# EasyEDA Pro project ZeptoWatch.eprj, board PCB4
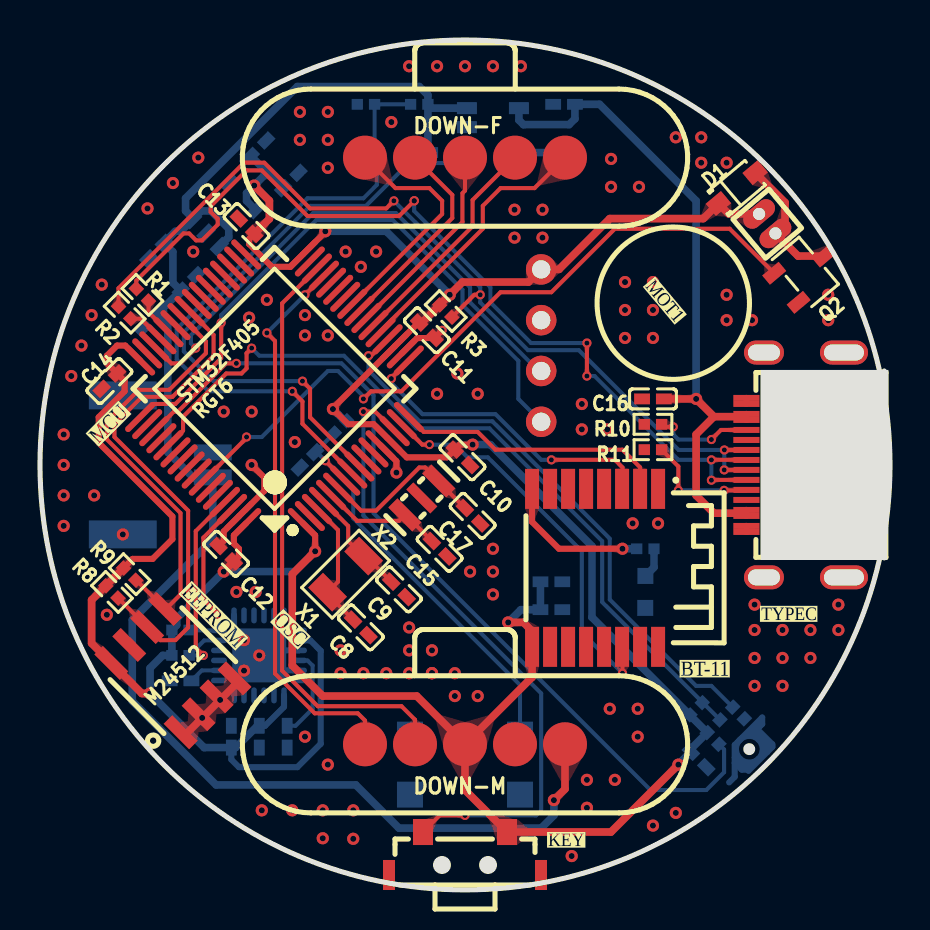
[diagram p12: board, top side]
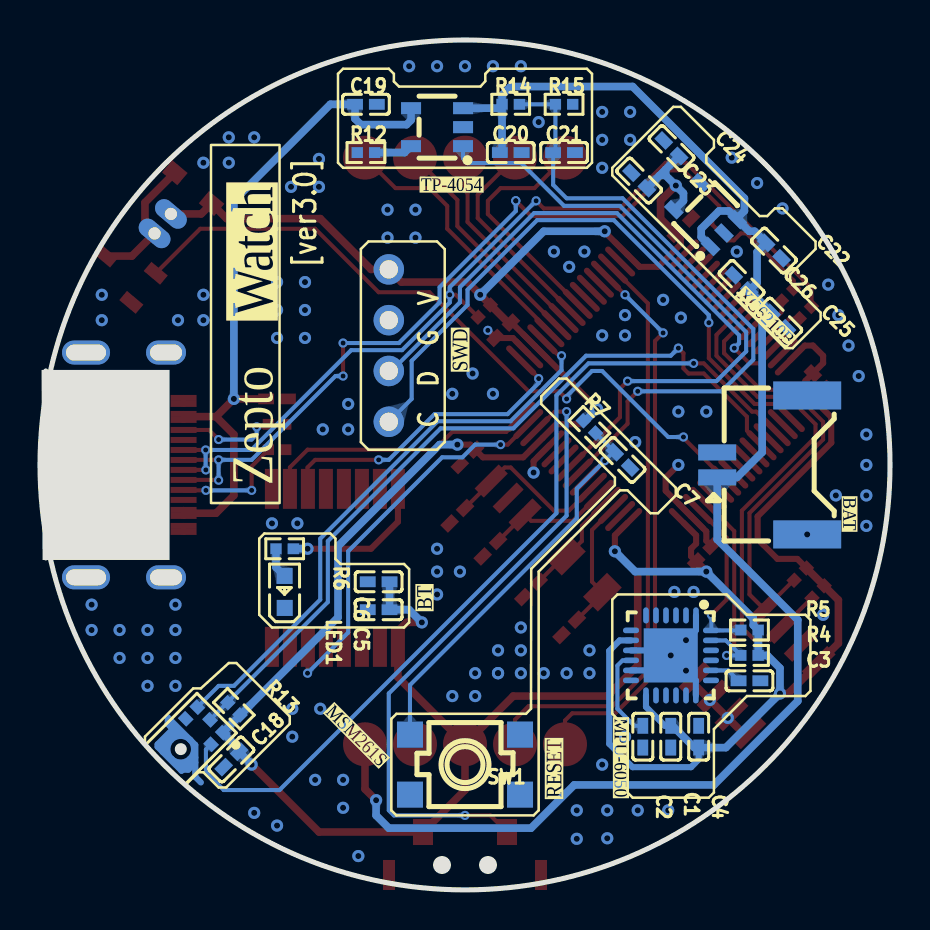
[diagram p13: board, bottom side, seen from below]

Outline 42.5 x 42.5 mm; copper layers: Top Layer, Bottom Layer. Coordinates in mm from the lower left corner of the outline.
Outline path: circle c21.25,21.25 r21.25
Stack: Top Layer 0.035mm / Dielectric1 1.51mm FR4 er 4.5 / Bottom Layer 0.035mm

## Design rules (mm)
spacing safeClearance (default): track to track 0.152, other pairs 0 to 0.152
track width trackWidth (default): min 0.127, default 0.254, max 2.54
differential pair differentialPair (default): width min 0.127, default 0.254, max 2.54; gap min 0.152, default 0.152
via viaSize (default): diameter min 0.381, default 0.457, max 10; hole min 0.203, default 0.254, max 5.999

## Placement (name value [footprint] x y rotation side)
 BAT   -  [CONN-SMD_2P-P1.25_L5.5-W7.7-2PWB]  6.39 21.25 90 bottom
 BT-11   -  [BT-11]  34.2 19.85 270 top
 KEY   -  [SW-SMD_TS-KG012EV]  21.25 1.82 0 top
 MOT1   -  [VIBRATING-MOTOR-SMD_WELDING]  36.36 33.31 130 top
 MPU-6050   -  [QFN-24_L4.0-W4.0-P0.50-BL-EP2.7]  10.95 11.72 0 bottom
 MSM261S   -  [MIC-SMD_6P-L3.5-W2.7-P0.90-TR]  34.97 7.53 225 bottom
 TP-4054   -  [SOT-23-5_L3.0-W1.7-P0.95-LS2.8-BR]  22.65 38.14 180 bottom
 TYPEC   -  [USB-C-SMD_TYPE-C-16M-005]  37.76 21.25 90 top
 XC6210B   -  [SOT-25_L3.0-W1.6-P0.95-LS2.8-BL]  9.22 33.77 135 bottom
C1  100nF  [C0402]  10.96 7.66 90 bottom
C2  100nF  [C0402]  12.36 7.66 270 bottom
C3  2.2nF  [C0402]  7.03 10.45 180 bottom
C4  100nF  [C0402]  9.57 7.66 270 bottom
C5  100nF  [C0402]  25.57 14.01 0 bottom
C6  10uF  [C0402]  25.57 15.41 180 bottom
C7  100nF  [C0402]  13.38 21.5 45 bottom
C8  10pF  [C0402]  16.04 13.13 135 top
C9  10pF  [C0402]  17.95 15.03 135 top
C10  100nF  [C0402]  21.12 21.63 315 top
C11  100nF  [C0402]  19.34 27.99 315 top
C12  100nF  [C0402]  9.31 16.81 135 top
C13  100nF  [C0402]  10.33 33.19 135 top
C14  100nF  [C0402]  3.47 25.44 45 top
C15  20pF  [C0402]  19.98 17.06 135 top
C16  10uF  [C0402]  30.65 24.55 0 top
C17  20pF  [C0402]  21.63 18.71 135 top
C18  100nF  [C0402]  32.93 6.52 315 bottom
C19  100nF  [C0402]  26.2 39.28 180 bottom
C20  100nF  [C0402]  18.96 36.87 180 bottom
C21  100nF  [C0402]  16.3 36.87 180 bottom
C22  100nF  [C0402]  5.81 31.97 225 bottom
C23  100nF  [C0402]  12.54 35.47 45 bottom
C24  10uF  [C0402]  10.92 37.09 225 bottom
C25  10uF  [C0402]  5.54 28.47 45 bottom
C26  100nF  [C0402]  7.42 30.36 45 bottom
D1  B5819WS  [SOD-323_L1.8-W1.3-LS2.5-FD]  34.84 35.09 220 top
DOWN-F  -  [pogo-5pin-f]  21.25 36.62 180 top
DOWN-M  -  [pogo-5pin-m]  21.25 7.28 180 top
LED1  D-060306B1  [LED0603-RD]  30.27 14.9 90 bottom
M24512  M24512-DRMN8TP/K  [SO-8_L4.9-W3.9-P1.27-LS6.0-BL]  6.65 10.96 45 top
NOREF  -  [Pad_e232]  25.06 25.95 45 top
NOREF#2  -  [Pad_e231]  25.06 28.49 45 top
NOREF#3  -  [Pad_e230]  25.06 31.03 45 top
NOREF#4  -  [Pad_e233]  25.06 23.41 45 top
Q2  AO3400A  [SOT-23-3_L2.9-W1.6-P1.90-LS2.8-BR]  38.27 30.9 220 top
R1  22Ω  [R0402]  5.12 29.76 315 top
R2  22Ω  [R0402]  4.23 28.87 315 top
R3  1.5kΩ  [R0402]  20.29 28.94 315 top
R4  2.2kΩ  [R0402]  7.03 11.72 0 bottom
R5  2.2kΩ  [R0402]  7.03 13 0 bottom
R6  1kΩ  [R0402]  30.27 17.06 180 bottom
R7  47kΩ  [R0402]  15.03 23.16 45 bottom
R8  10kΩ  [R0402]  3.6 14.9 315 top
R9  10kΩ  [R0402]  4.49 15.79 315 top
R10  5.1kΩ  [R0402]  30.65 23.28 0 top
R11  5.1kΩ  [R0402]  30.65 22.01 180 top
R12  2kΩ  [R0402]  26.2 36.87 180 bottom
R13  100kΩ  [R0402]  32.81 9.06 45 bottom
R14  20kΩ  [R0402]  18.96 39.28 180 bottom
R15  20kΩ  [R0402]  16.3 39.28 180 bottom
STM32F405
RGT6  -  [LQFP-64_L10.0-W10.0-P0.50-LS12.0-BL]  11.72 25.06 45 top
SW1  TS-1127-C  [SW-SMD_4P-L4.5-W4.5-P3.00-LS6.0]  21.25 6.26 180 bottom
X1  32.768kHz  [OSC-SMD_L3.2-W1.5]  15.28 15.79 225 top
X2  8MHz  [OSC-SMD_3P-L3.2-W1.3-P1.2-L]  19.09 19.6 45 top

## Footprints (pads in the part's own frame, mm; a bottom-side part is the same pattern mirrored in y, then rotated)
BT-11
  rect 2x0.7 smd: 1(-0.2,-3.3) 2(-0.2,-4.2) 3(-0.2,-5.1) 4(-0.2,-6) 5(-0.2,-6.9) 6(-0.2,-7.8) 7(-0.2,-8.7) 8(-0.2,-9.6) 9(7.7,-9.6) 10(7.7,-8.7) 11(7.7,-7.8) 12(7.7,-6.9) 13(7.7,-6) 14(7.7,-5.1) 15(7.7,-4.2) 16(7.7,-3.3)
C0402
  rect 0.79x0.54 smd: 1(-0.545,0) 2(0.545,0)
CONN-SMD_2P-P1.25_L5.5-W7.7-2PWB
  rect 0.8x1.9 smd: 1(-0.625,2.25) 2(0.625,2.25)
  rect 1.4x3.4 smd: 3(3.475,-2.25) 4(-3.475,-2.25)
LED0603-RD
  rect 0.8x0.8 smd: 1(-0.799,-0.004) 2(0.799,0.004)
LQFP-64_L10.0-W10.0-P0.50-LS12.0-BL
  oval 0.3x2 smd: 1(-3.75,-5.75) 2(-3.25,-5.75) 3(-2.75,-5.75) 4(-2.25,-5.75) 5(-1.75,-5.75) 6(-1.25,-5.75) 7(-0.75,-5.75) 8(-0.25,-5.75) 9(0.25,-5.75) 10(0.75,-5.75) 11(1.25,-5.75) 12(1.75,-5.75) 13(2.25,-5.75) 14(2.75,-5.75) 15(3.25,-5.75) 16(3.75,-5.75) 33(3.75,5.75) 34(3.25,5.75) 35(2.75,5.75) 36(2.25,5.75) 37(1.75,5.75) 38(1.25,5.75) 39(0.75,5.75) 40(0.25,5.75) 41(-0.25,5.75) 42(-0.75,5.75) 43(-1.25,5.75) 44(-1.75,5.75) 45(-2.25,5.75) 46(-2.75,5.75) 47(-3.25,5.75) 48(-3.75,5.75)
  oval 2x0.3 smd: 17(5.75,-3.75) 18(5.75,-3.25) 19(5.75,-2.75) 20(5.75,-2.25) 21(5.75,-1.75) 22(5.75,-1.25) 23(5.75,-0.75) 24(5.75,-0.25) 25(5.75,0.25) 26(5.75,0.75) 27(5.75,1.25) 28(5.75,1.75) 29(5.75,2.25) 30(5.75,2.75) 31(5.75,3.25) 32(5.75,3.75) 49(-5.75,3.75) 50(-5.75,3.25) 51(-5.75,2.75) 52(-5.75,2.25) 53(-5.75,1.75) 54(-5.75,1.25) 55(-5.75,0.75) 56(-5.75,0.25) 57(-5.75,-0.25) 58(-5.75,-0.75) 59(-5.75,-1.25) 60(-5.75,-1.75) 61(-5.75,-2.25) 62(-5.75,-2.75) 63(-5.75,-3.25) 64(-5.75,-3.75)
MIC-SMD_6P-L3.5-W2.7-P0.90-TR
  rect 0.6x0.52 smd: 1(0.9,1.367) 2(0.9,0.545) 4(-0.9,0.545) 5(-0.9,1.367) 6(0,1.368)
  custom 0x0 smd: 3(0,-1.368) 3(0,-0.042)
OSC-SMD_3P-L3.2-W1.3-P1.2-L
  rect 0.65x1.7 smd: 1(-1.199,0) 3(1.199,0)
  rect 0.5x1.7 smd: 2(0,0)
OSC-SMD_L3.2-W1.5
  rect 1.049x1.7 smd: 1(-1.275,0) 2(1.275,0)
Pad_e230
  round 1.524 hole 0.914: 1(0,0)
Pad_e231
  round 1.524 hole 0.914: 2(0,0)
Pad_e232
  round 1.524 hole 0.914: 3(0,0)
Pad_e233
  round 1.524 hole 0.914: 4(0,0)
pogo-5pin-f
  round 2.2 smd: 1(5,0) 2(2.5,0) 3(0,0) 4(-2.5,0) 5(-5,0)
pogo-5pin-m
  round 2.2 smd: 1(-5,0) 2(-2.5,0) 3(0,0) 4(2.5,0) 5(5,0)
QFN-24_L4.0-W4.0-P0.50-BL-EP2.7
  oval 0.28x0.8 smd: 1(-1.25,-2) 2(-0.75,-2) 3(-0.25,-2) 4(0.25,-2) 5(0.75,-2) 6(1.25,-2) 13(1.25,2) 14(0.75,2) 15(0.25,2) 16(-0.25,2) 17(-0.75,2) 18(-1.242,2)
  oval 0.8x0.28 smd: 7(2,-1.25) 8(2,-0.75) 9(2,-0.25) 10(2,0.25) 11(2,0.75) 12(2,1.25) 19(-2,1.25) 20(-2,0.75) 21(-2,0.25) 22(-2,-0.25) 23(-2,-0.75) 24(-2,-1.25)
  rect 2.7x2.7 smd: 25(0.013,0)
R0402
  rect 0.566x0.54 smd: 1(-0.433,0) 2(0.433,0)
SO-8_L4.9-W3.9-P1.27-LS6.0-BL
  rect 0.6x1.801 smd: 1(-1.905,-2.451) 2(-0.635,-2.451) 3(0.635,-2.451) 4(1.905,-2.451) 5(1.905,2.451) 6(0.635,2.451) 7(-0.635,2.451) 8(-1.905,2.451)
SOD-323_L1.8-W1.3-LS2.5-FD
  rect 1x0.8 smd: 1(-1.2,0) 2(1.2,0)
SOT-23-3_L2.9-W1.6-P1.90-LS2.8-BR
  rect 1.07x0.6 smd: 1(1.235,-0.95) 2(1.235,0.95) 3(-1.235,0)
SOT-23-5_L3.0-W1.7-P0.95-LS2.8-BR
  rect 1x0.6 smd: 1(1.3,-0.95) 2(1.3,0) 3(1.3,0.95) 4(-1.3,0.95) 5(-1.3,-0.95)
SOT-25_L3.0-W1.6-P0.95-LS2.8-BL
  rect 0.5x0.899 smd: 1(-0.95,-1.3) 2(0,-1.3) 3(0.95,-1.3) 4(0.95,1.3) 5(-0.95,1.3)
SW-SMD_4P-L4.5-W4.5-P3.00-LS6.0
  rect 1.3x1.3 smd: 1(-2.751,1.501) 2(2.751,1.501) 3(-2.751,-1.501) 4(2.751,-1.501)
SW-SMD_TS-KG012EV
  rect 1.001x1.3 smd: 1(2.1,1.075) 2(-2.1,1.075)
  rect 0.6x1.501 smd: 3(-3.8,-1.075) 4(3.8,-1.075)
USB-C-SMD_TYPE-C-16M-005
  oval 1.199x1.999 hole 0.8x1.6: 17(5.621,1.562) 20(-5.621,1.562)
  oval 1.199x2.401 hole 0.8x1.999: 18(5.621,-2.438) 19(-5.621,-2.438)
  rect 0.299x1.3 smd: A1(-3.35,2.438) A4(-2.55,2.438) A5(-1.25,2.438) A6(-0.249,2.438) A7(0.249,2.438) A8(1.25,2.438) A9(2.55,2.438) A12(3.35,2.438) B1(3.05,2.438) B4(2.251,2.438) B5(1.75,2.438) B6(0.75,2.438) B7(-0.75,2.438) B8(-1.75,2.438) B9(-2.251,2.438) B12(-3.05,2.438)
VIBRATING-MOTOR-SMD_WELDING
  oval 0.9x1.8 hole 0.61: 1(-0.635,0) 2(0.635,0)

## Nets
GND:  BAT .2  BAT .3  BAT .4  BT-11 .1  BT-11 .15  KEY .3  KEY .4  MPU-6050 .1  MPU-6050 .9  MPU-6050 .11  MPU-6050 .18  MPU-6050 .25  MSM261S .3  MSM261S .4  TP-4054 .2  TYPEC .17  TYPEC .18  TYPEC .19  TYPEC .20  TYPEC .A1  TYPEC .A12  TYPEC .B1  TYPEC .B12  XC6210B .2 C1.1 C2.2 C3.2 C4.1 C5.2 C6.1 C7.1 C8.1 C9.1 C10.2 C11.2 C12.2 C13.2 C14.1 C15.1 C16.1 C17.1 C18.2 C19.2 C20.2 C21.2 C22.2 C23.2 C24.1 C25.1 C26.2 DOWN-M.2 LED1.1 M24512.1 M24512.2 M24512.3 M24512.4 M24512.7 NOREF#2.2 Q2.2 R10.1 R11.2 R12.1 R15.2 STM32F405
RGT6.12 STM32F405
RGT6.18 STM32F405
RGT6.63 SW1.3 X2.2
VBAT:  BAT .1  TP-4054 .3  XC6210B .1  XC6210B .3 C20.1 C22.1 C25.2 C26.1 DOWN-M.1 R14.1
VBUS:  TP-4054 .4  TYPEC .A4  TYPEC .A9  TYPEC .B4  TYPEC .B9 C16.2 C19.1
VCC_3V3:  BT-11 .9  KEY .1  MOT1 .2  MPU-6050 .8  MPU-6050 .13  MSM261S .1  XC6210B .5 C1.2 C4.2 C5.1 C6.2 C10.1 C11.1 C12.1 C13.1 C14.2 C18.1 C23.1 C24.2 D1.2 DOWN-M.3 M24512.8 NOREF#3.1 R3.1 R4.1 R5.1 R7.2 R8.1 R9.1 R13.1 STM32F405
RGT6.1 STM32F405
RGT6.13 STM32F405
RGT6.19 STM32F405
RGT6.32 STM32F405
RGT6.48 STM32F405
RGT6.64
BAT_ADC: C21.1 R14.2 R15.1 STM32F405
RGT6.8
BAT_CHRG_R:  TP-4054 .1 STM32F405
RGT6.9
BT_RST:  BT-11 .14 STM32F405
RGT6.15
I2S_CK:  MSM261S .2 STM32F405
RGT6.51
I2S_SD:  MSM261S .6 R13.2 STM32F405
RGT6.53
I2S_WS:  MSM261S .5 STM32F405
RGT6.20
IMU_SCL:  MPU-6050 .23 R4.2 STM32F405
RGT6.61
IMU_SDA:  MPU-6050 .24 R5.2 STM32F405
RGT6.62
KEY_INT:  KEY .2 STM32F405
RGT6.14
LCD_BLK: DOWN-F.4 STM32F405
RGT6.22
LCD_DC: DOWN-F.1 STM32F405
RGT6.25
LCD_RST: DOWN-F.2 STM32F405
RGT6.24
LCD_SCL: DOWN-F.5 STM32F405
RGT6.21
LCD_SDA: DOWN-F.3 STM32F405
RGT6.23
MOTOR: Q2.1 STM32F405
RGT6.58
OSC32_IN: C8.2 STM32F405
RGT6.3 X1.2
OSC32_OUT: C9.2 STM32F405
RGT6.4 X1.1
OSC_IN: C15.2 STM32F405
RGT6.5 X2.1
OSC_OUT: C17.2 STM32F405
RGT6.6 X2.3
ROM_SCL: M24512.6 R8.2 STM32F405
RGT6.41
ROM_SDA: M24512.5 R9.2 STM32F405
RGT6.42
SWCLK: NOREF#4.4 STM32F405
RGT6.49
SWDIO: NOREF.3 STM32F405
RGT6.46
TP_SCL: DOWN-M.5 STM32F405
RGT6.29
TP_SDA: DOWN-M.4 STM32F405
RGT6.30
UART_RX:  BT-11 .3 STM32F405
RGT6.17
UART_TX:  BT-11 .2 STM32F405
RGT6.16
USB_DN: R1.2 STM32F405
RGT6.44
USB_DN_IN:  TYPEC .A7  TYPEC .B7 R1.1
USB_DP: R2.2 STM32F405
RGT6.45
USB_DP_IN:  TYPEC .A6  TYPEC .B6 R2.1 R3.2
$1N145557:  MPU-6050 .10 C2.1
$1N145559:  MPU-6050 .20 C3.1
$1N145571: C7.2 R7.1 STM32F405
RGT6.7 SW1.1
$1N145574:  TYPEC .B5 R10.2
$1N145577:  TYPEC .A5 R11.1
$1N145631:  MOT1 .1 D1.1 Q2.3
$1N145644:  TP-4054 .5 R12.2
$1N145663: LED1.2 R6.1
$1N145664:  BT-11 .8 R6.2

Pads without a net:  BT-11  4 5 6 7 10 11 12 13 16;  MPU-6050  2 3 4 5 6 7 12 14 15 16 17 19 21 22;  TYPEC  A8 B8;  XC6210B  4; STM32F405
RGT6 2 10 11 26 27 28 31 33 34 35 36 37 38 39 40 43 47 50 52 54 55 56 57 59 60; SW1 2 4

## Via types
v1: diameter 0.61, hole 0.305, Top Layer to Bottom Layer, 134 vias
v2: diameter 0.457, hole 0.254, Top Layer to Bottom Layer, 35 vias

## Routing (per net, layer and track width the routed paths; a pad name or vN(x,y) marks a point on that pad's centre or on a via; arc(x,y) is an arc through that point)
GND: length 33.3
  Top Layer w0.305: v2(20.11,27.98) C11.2 19.72,27.6 18.86,27.6 18.09,26.83 ; C12.2 9.19,17.46 9.19,17.92 STM32F405
RGT6.63 11.22,19.96 11.22,20.61 v1(10.58,21.25) ;  TYPEC .A1  TYPEC .B12 ; v1(17.82,20.87) 17.82,21.44 STM32F405
RGT6.12 ;  TYPEC .B1  TYPEC .A12
  Top Layer w0.381: 9.91,10.4 v1(9.01,9.5) v1(8.11,8.6) 7.21,7.7
  Bottom Layer w0.305: 35.73,8.17 35.73,7.92 35.6,7.79 35.85,7.79 36.36,7.28 36.36,6.9 ; 35.73,8.17 35.98,8.17 36.11,8.3 36.11,8.62  MSM261S .3 34.74,7.25 34.74,6.62 ; 35.73,8.17 36.62,7.28 36.62,7.15 36.36,6.9 ; 36.36,6.9 35.43,5.96 35.38,6.01 ; 35.38,6.01 35.5,6.14 ; 35.38,6.01 35.09,6.01 34.74,6.37 ; 35.5,6.14 35.93,6.57 ; 35.5,6.14 35.22,6.14 34.74,6.62 ;  MPU-6050 .11 11.71,10.97 v1(10.96,11.72) 11.21,11.97  MPU-6050 .9 ; v1(10.2,10.96) 9.71,10.47  MPU-6050 .18 ; v1(10.2,12.49) 9.7,12.99  MPU-6050 .1 ; 34.74,6.37 34.74,6.62 ; 34.74,6.37 34.74,5.65 34.46,5.38
  vias: v1(1.18,22.77) v1(1.18,21.25) v1(1.18,19.73) v1(1.18,18.2) v1(1.56,25.69) v1(2.07,27.22) v1(2.58,28.74) v1(2.71,19.73) v1(3.09,30.27) v1(3.34,13.76) v1(4.14,17.78) v1(5.38,34.08) v1(6.65,35.35) v1(7.66,31.92) v1(7.91,36.62) v1(9.19,23.92) v1(9.82,14.9) v1(10.46,28.62) v1(10.58,23.92) v1(10.78,14.9) v1(11.09,3.98) v1(11.34,29.5) v1(12.61,3.98) v1(12.74,22.39) v1(13,38.9) v1(13,37.51) v1(13.25,28.74) v1(13.25,27.73) v1(13.25,7.66) v1(14.14,3.98) v1(14.14,2.58) v1(14.39,38.9) v1(14.39,37.51) v1(14.39,36.11) v1(14.39,27.73) v1(14.39,6.26) v1(15.03,11.98) v1(15.03,10.84) v1(15.28,31.92) v1(15.66,3.98) v1(15.66,2.55) v1(16.04,31.16) v1(16.17,10.84) v1(16.81,31.92) v1(17.31,10.84) v1(17.57,38.39) v1(18.46,41.19) v1(18.46,13.12) v1(18.46,11.98) v1(18.46,10.84) v1(19.6,11.98) v1(19.6,10.84) v1(19.6,10.84) v1(19.85,41.19) v1(19.85,24.81) v1(20.74,10.84) v1(20.74,9.69) v1(20.87,25.82) v1(21.25,41.19) v1(21.5,15.92) v1(21.88,24.81) v1(21.88,9.69) v1(22.65,41.19) v1(22.65,17.06) v1(22.65,15.92) v1(22.65,14.77) v1(23.73,34.01) v1(23.73,32.62) v1(24.04,41.19) v1(25.12,34.01) v1(25.12,32.62) v1(26.58,1.69) v1(27.09,24.3) v1(27.09,23.03) v1(27.35,5.5) v1(27.35,4.11) v1(28.36,23.03) v1(28.49,9.06) v1(28.55,36.55) v1(28.55,35.16) v1(28.74,5.5) v1(29.25,30.39) v1(29.25,29) v1(29.25,27.6) v1(29.63,18.33) v1(29.89,9.06) v1(29.89,7.66) v1(29.95,35.16) v1(30.65,30.39) v1(30.65,29) v1(30.65,27.6) v1(30.65,3.22) v1(30.9,18.33) v1(31.79,37.63) v1(31.79,3.85) v1(33.06,37.63) v1(33.06,36.36) v1(34.33,36.36) v1(34.33,29.76) v1(34.33,28.49) v1(35.6,28.49) v1(35.73,14.27) v1(35.73,13) v1(35.73,11.6) v1(35.73,10.2) v1(37.12,13) v1(37.12,11.6) v1(37.12,10.2) v1(38.52,13) v1(38.52,11.6) v1(39.41,29.76) v1(39.41,28.49) v1(39.92,14.27) v1(39.92,13)
VBAT: length 81
  Top Layer w0.381: v1(25.69,4.49) 26.25,5.04 DOWN-M.1
  Bottom Layer w0.381:  XC6210B .1 9.44,32.65 9.44,33.06 8.55,33.95 8.06,33.95  XC6210B .3 ;  XC6210B .3 7.04,32.93 6.77,32.93 6.19,32.36 6.65,31.9 6.65,30.36 C26.1 5.92,28.85 6.39,28.38 6.39,21.89 7.65,20.62  BAT .1 8.64,17.53 4.61,13.5 4.61,9.44 8.8,5.25 15.79,5.25 17.95,3.09 25.06,3.09 25.69,3.72 v1(25.69,4.49) ;  XC6210B .3 7.63,33.6 7.28,33.95 7.28,34.58 12.87,40.17 18.96,40.17 19.4,39.74 R14.1 ; 21.35,39.09 19.59,39.09 R14.1 ; R14.1 19.4,36.98 C20.1
VBUS: length 34.7
  Top Layer w0.305:  TYPEC .A4  TYPEC .B9 35.16,18.84 ;  TYPEC .A9  TYPEC .B4 35.16,23.66
  Top Layer w0.381: 31.19,24.55 v1(32.81,24.55) 33.7,23.66 ; 33.7,23.66 32.81,22.77 32.81,19.73 33.7,18.84 35.16,18.84 ; 33.7,23.66 35.16,23.66
  Bottom Layer w0.381: 23.95,39.09 23.95,38.49 24.17,38.27 26.46,38.27 26.75,38.56 C19.1 27.98,39.28 32.81,34.46 v1(32.81,24.55)
VCC_3V3: length 185.5
  Top Layer w0.305: 9.69,16.42 9.95,16.68 9.95,17.06 9.69,17.31 9.69,17.72 STM32F405
RGT6.64 ; 13.14,18.34 13.76,17.72 v1(13.76,16.93) ; STM32F405
RGT6.48 4.26,27.22 3.85,27.22 3.34,26.71 3.34,26.34 C14.2 4.23,25.45 4.23,24.93 2.94,23.64 2.94,22.36 6.62,18.67 6.62,17.54 5.63,16.55 4.64,16.55 4.18,16.09 ; v1(21.63,22.27) 20.99,22.27 C10.1 20.35,21.63 18.34,21.63 STM32F405
RGT6.13 16.68,23.29 15.4,23.29 v1(14.65,24.04) 14.65,24.09 STM32F405
RGT6.19 18.93,28.37 ; C13.1 10.46,32.54 10.46,32.3 11.6,31.16 12.52,31.16 14.26,32.9 v1(14.26,32.93)
  Top Layer w0.381: 18.96,28.37 19.1,28.37 v1(20.49,29.76) 21.12,30.39 24.43,30.39 NOREF#3.1 25.95,31.03 28.49,33.57 33.17,33.57 D1.2 34.44,33.8  MOT1 .2 ; DOWN-M.3 24.6,10.63 24.6,12.94 24.17,13.38 v1(23.41,13.38) ; DOWN-M.3 18.84,9.69 14.14,9.69 12.61,11.22 12.61,15.79 v1(13.76,16.93) ; DOWN-M.3 21.25,4.99  KEY .1 28.55,2.89 v1(31.92,6.26) ; v1(9.19,15.92) 9.69,16.42 ; v1(10.71,35.22) 11.47,34.46 11.47,33.56 C13.1 ; v1(5.5,9.82) 5.09,9.82 2.58,12.33 2.58,14.5 R8.1 4.18,16.09
  Bottom Layer w0.305: C4.2 9.57,6.52 9.95,6.14 12.87,6.14 14.04,7.31 14.04,11.95 13.51,12.47  MPU-6050 .8 ; C1.2 11.25,8.21 12.2,9.15  MPU-6050 .13
  Bottom Layer w0.381: 11.22,35.73 v1(10.71,35.22) 10.33,34.84 10.33,34.46 10.77,34.02 10.81,34.02 ; 11.22,35.73 11.51,35.73 ; 11.22,35.73 11.22,36.03 ; 11.22,36.03 11.51,35.73 ; 11.22,36.03 C24.2 ; 11.51,35.73 12.16,35.09 ; v1(21.63,22.27) 22.52,22.27 27.6,17.19 27.6,13.63 32.5,8.73 ; R7.2 15.23,23.46 v1(14.65,24.04) ; v1(23.41,13.38) 24.04,14.01 25.02,14.01 25.02,15.41 ; v1(20.49,29.76) 17.31,32.93 v1(14.26,32.93) ; v1(31.92,6.26) 31.92,6.28 C18.1 32.54,7.05  MSM261S .1 32.5,8.73 ; 32.5,8.73 32.5,8.75 ; C1.2 10.87,8.21 9.78,7.12 C4.2 8.21,7.12 v1(5.5,9.82) 5.5,11.09 6.14,11.72 R4.1 R5.1 6.83,13.23 6.83,13.56 v1(9.19,15.92) 12.74,15.92 v1(13.76,16.93)
BAT_ADC: length 32.2
  Top Layer w0.203: v2(12.61,24.93) 13.12,24.42 13.12,23.31 STM32F405
RGT6.8
  Bottom Layer w0.203: v2(12.61,24.93) 8.42,24.93 6.84,26.52 6.84,28.04 13.38,34.58 16.17,34.58 16.84,35.26 C21.1 16.73,36.98 R15.1 R14.2
BAT_CHRG_R: length 31.3
  Top Layer w0.203: STM32F405
RGT6.9 13.5,23.64 13.5,25.06 v2(13.12,25.44)
  Bottom Layer w0.203:  TP-4054 .1 21.35,36.59 21.11,36.35 18.44,36.35 16.3,34.2 13.5,34.2 7.19,27.89 7.19,26.93 8.68,25.44 v2(13.12,25.44)
BT_RST: length 19.9
  Top Layer w0.203: v2(19.47,22.27) 19.12,22.27 18.09,23.29 ; 29.1,12.15 29.12,12.13 v2(29.12,10.84)
  Bottom Layer w0.203: v2(29.12,10.84) 27.09,12.87 27.09,16.93 22.39,21.63 21.38,21.63 20.74,22.27 v2(19.47,22.27)
I2S_CK: length 44.1
  Top Layer w0.203: v2(9.82,26.33) 9.31,26.33 6.9,23.92 6.69,23.92 STM32F405
RGT6.51
  Bottom Layer w0.203: v2(9.82,26.33) 15.07,26.33 16.68,24.73 16.68,18.84 30.52,4.99 33.31,4.99 34.2,5.88 34.2,7.02  MSM261S .2
I2S_SD: length 39.9
  Top Layer w0.203: STM32F405
RGT6.53 7.15,22.96 7.15,23.66 9.31,25.82 10.07,25.82 10.33,26.08 10.33,26.84 v2(10.58,27.09)
  Bottom Layer w0.203: v2(10.58,27.09) 10.96,26.71 15.2,26.71 18.83,23.08 22.47,23.08 28.11,17.44 28.11,14.39 33.11,9.39 R13.2 33.14,9.36 34,8.5
I2S_WS: length 29
  Top Layer w0.203: STM32F405
RGT6.20 16.56,26.71 v2(16.42,26.71)
  Bottom Layer w0.203:  MSM261S .5 34.63,9.14 33.57,10.2 32.8,10.2 28.49,14.51 28.49,17.56 22.62,23.43 18.98,23.43 16.42,25.99 v2(16.42,26.71)
IMU_SCL: length 11
  Top Layer w0.203: v2(8.17,11.72) 7.79,12.11 7.79,17.94 STM32F405
RGT6.61
  Bottom Layer w0.203:  MPU-6050 .23 8.21,12.47 R4.2 v2(8.17,11.72)
IMU_SDA: length 8.5
  Top Layer w0.203: STM32F405
RGT6.62 8.17,17.61 8.17,14.52 v2(8.93,13.76)
  Bottom Layer w0.203: R5.2 7.48,12.97  MPU-6050 .24 8.93,12.99 v2(8.93,13.76)
KEY_INT: length 32
  Top Layer w0.203: STM32F405
RGT6.14 16.76,23.92 v2(16.17,23.92) ; v2(21.25,3.72) 19.98,3.72  KEY .2
  Bottom Layer w0.203: v2(21.25,3.72) 24.81,3.72 25.06,3.98 25.06,9.83 16.17,18.72 v2(16.17,23.92)
LCD_BLK: length 11.3
  Top Layer w0.203: STM32F405
RGT6.22 16.69,28.24 21.63,33.19 21.63,34.5 DOWN-F.4
LCD_DC: length 11.8
  Top Layer w0.203: STM32F405
RGT6.25 20.11,33.8 20.11,34.46 19.47,35.09 17.77,35.09 DOWN-F.1
LCD_RST: length 10.4
  Top Layer w0.203: DOWN-F.2 20.62,34.75 20.62,33.6 STM32F405
RGT6.24
LCD_SCL: length 13.5
  Top Layer w0.203: DOWN-F.5 24.73,35.09 23.03,35.09 22.14,34.2 22.14,33.06 17.03,27.95 STM32F405
RGT6.21
LCD_SDA: length 10.1
  Top Layer w0.203: STM32F405
RGT6.23 21.12,33.4 21.12,34.84 21.25,34.97 DOWN-F.3
MOTOR: length 35.9
  Top Layer w0.203: v2(16.17,24.55) 16.55,24.93 18.07,24.93 23.03,29.89 25.57,29.89 28.74,33.06 34.49,33.06 Q2.1 ; v2(10.33,22.65) 10.33,22.6 STM32F405
RGT6.58
  Bottom Layer w0.203: v2(10.33,22.65) 11.09,22.65 14.39,25.95 14.9,25.95 16.17,24.68 v2(16.17,24.55)
OSC32_IN: length 6.7
  Top Layer w0.203: STM32F405
RGT6.3 14.9,18 14.9,15.41 X1.2 14.38,14.79 C8.2
OSC32_OUT: length 5.5
  Top Layer w0.203: C9.2 16.28,16.69 X1.1 16.16,16.69 15.41,17.44 15.41,18.19 STM32F405
RGT6.4
OSC_IN: length 6.2
  Top Layer w0.203: 14.55,19.76 15.85,18.46 17.95,18.46 X2.1 18.29,18.75 C15.2
OSC_OUT: length 8.6
  Top Layer w0.203: STM32F405
RGT6.6 16.05,18.96 16.81,18.96 18.96,21.12 19.26,21.12 X2.3 19.94,20.4 C17.2
ROM_SCL: length 25.4
  Top Layer w0.203: 3.9,14.59 3.91,14.59 6.02,12.49 6.77,12.49 7.41,13.12 7.41,18.96 3.72,22.65 3.72,23.28 5.1,24.65 6.62,24.65 8.68,26.71 8.68,27.75 STM32F405
RGT6.41
ROM_SDA: length 21.8
  Top Layer w0.203: 7.13,28.6 8.3,27.43 8.3,26.84 6.47,25.01 4.94,25.01 3.34,23.41 3.34,22.53 7.03,18.84 7.03,14.77 6.48,14.22 6.08,14.22 4.82,15.48 R9.2
SWCLK: length 31.1
  Top Layer w0.203: v2(9.06,28.36) 9.06,26.59 6.77,24.3 5.66,24.3 STM32F405
RGT6.49
  Bottom Layer w0.203: v2(9.06,28.36) 9.06,28.74 13.81,33.49 17.64,33.49 21.12,30.01 21.12,29.25 23.92,26.46 23.92,24.55 NOREF#4.4
SWDIO: length 27.2
  Top Layer w0.203: v2(7.79,27.09) 7.03,26.33 6.57,26.33 STM32F405
RGT6.46
  Bottom Layer w0.203: v2(7.79,27.09) 7.55,27.33 7.55,27.74 13.66,33.85 17.79,33.85 21.5,30.14 21.5,29.38 24.93,25.95 NOREF.3
TP_SCL: length 27.9
  Top Layer w0.203: DOWN-M.5 16.25,8.47 15.89,8.83 13.74,8.83 11.75,10.82 11.75,27.45 v2(11.34,27.85) ; STM32F405
RGT6.29 14.2,30.71 v2(13.25,29.76)
  Bottom Layer w0.203: v2(11.34,27.85) v2(13.25,29.76)
TP_SDA: length 29.7
  Top Layer w0.203: STM32F405
RGT6.30 12.11,29.33 12.11,10.96 13.88,9.19 18.07,9.19 18.75,8.51 DOWN-M.4
UART_RX: length 15.9
  Top Layer w0.203: v2(17.57,25.57) 17.57,25.6 STM32F405
RGT6.17 ; v2(25.57,21.5) 28.74,21.5 29.12,21.12 29.12,20.07  BT-11 .3
  Bottom Layer w0.203: v2(17.57,25.57) 17.57,25.35 19.12,23.79 22.77,23.79 25.06,21.5 v2(25.57,21.5)
UART_TX: length 13.7
  Top Layer w0.203: STM32F405
RGT6.16 19.19,22.9 21.88,22.9 22.77,22.01 29.12,22.01 30,21.13  BT-11 .2
USB_DN: length 2
  Top Layer w0.203: STM32F405
RGT6.44 5.43,28.88 5.43,29.45
USB_DN_IN: length 45.6
  Top Layer w0.203: R1.1 4.81,30.47 7.17,32.83 7.46,32.83 7.81,32.48 8.09,32.48 8.88,33.27 8.88,33.56 8.54,33.9 8.54,34.19 10.33,35.98 11.09,35.98 13.38,33.7 17.95,33.7 v2(18.71,34.46) ; v2(27.35,27.35) v2(27.35,25.69) ;  TYPEC .B7 33.58,20.5 v2(33.57,20.49) ; v2(33.57,21.5) 35.32,21.5  TYPEC .A7
  Bottom Layer w0.203: v2(18.71,34.46) 18.71,33.94 22.52,30.14 22.52,29.38 24.55,27.35 v2(27.35,27.35) ; v2(27.35,25.69) 27.73,25.69 31.92,21.5 v2(33.57,21.5) v2(33.57,20.49)
USB_DP: length 2
  Top Layer w0.203: R2.2 5.04,28.56 STM32F405
RGT6.45
USB_DP_IN: length 45.6
  Top Layer w0.203: R3.2 21.71,29.76 v2(22.01,29.76) ; v2(17.69,34.46) 17.31,34.08 13.5,34.08 11.22,36.36 10.2,36.36 3.93,30.09 R2.1 ; v2(34.22,22)  TYPEC .B6 ; v2(34.21,21)  TYPEC .A6
  Bottom Layer w0.203: v2(17.69,34.46) 22.01,30.14 v2(22.01,29.76) 22.01,29.37 24.39,26.99 26.94,26.99 31.93,22 v2(34.22,22) 34.22,21.01 v2(34.21,21)
$1N145557: length 4.6
  Bottom Layer w0.203: C2.1 12.78,8.21 13.63,9.06 13.63,11.22 13.38,11.47 12.95,11.47  MPU-6050 .10
$1N145559: length 1.6
  Bottom Layer w0.203:  MPU-6050 .20 8.09,10.97 C3.1
$1N145571: length 21.2
  Top Layer w0.203: v2(14.26,21.46) STM32F405
RGT6.7
  Bottom Layer w0.203: SW1.1 24,10.24 15.66,18.58 15.66,20.06 v2(14.26,21.46) 13.84,21.89 C7.2 14.72,22.85
$1N145574: length 5
  Top Layer w0.203: R10.2 31.21,23.16 v2(31.66,23.16) ;  TYPEC .B5 34.05,23 v2(33.57,22.52)
  Bottom Layer w0.203: v2(31.66,23.16) 31.66,22.77 31.92,22.52 v2(33.57,22.52)
$1N145577: length 5.8
  Top Layer w0.203: R11.1 31.92,21.17 v2(31.92,19.98) ;  TYPEC .A5 35.3,19.98 v2(34.2,19.98)
  Bottom Layer w0.203: v2(34.2,19.98) v2(31.92,19.98)
$1N145631: length 6.8
  Top Layer w0.381: D1.1 37.25,34.37 37.25,33.31 36.77,32.83 37.9,31.7 Q2.3
$1N145644: length 2
  Bottom Layer w0.381: R12.2 24.27,36.87  TP-4054 .5
$1N145663: length 1.5
  Bottom Layer w0.381: LED1.2 30.7,16.13 R6.1
$1N145664: length 7.4
  Top Layer w0.305: v1(29.12,17.06) 25.95,17.06 24.6,18.4  BT-11 .8
  Bottom Layer w0.381: v1(29.12,17.06) R6.2

## Copper pours and planes (outline as drawn; the poured copper is in the pictures)
GND on Top Layer: -0.34,42.84 42.84,42.84 42.84,-0.34 -0.34,-0.34
GND on Bottom Layer: -0.34,42.84 42.84,42.84 42.84,-0.34 -0.34,-0.34

Small or netless copper shapes (teardrops, artwork), in the pictures only: 177 on Top Layer, 127 on Bottom Layer

## Text on the board
Bottom Silkscreen Layer: C  D  G  V | [ver3.0] | SWD | BT | RESET | Watch | Zepto
Top Silkscreen Layer: MCU | EEPROM | OSC
